# EAGLE design OutputZTester (EAGLE 7.2.0)

## Sheet 1 of 3: Droop Circuit
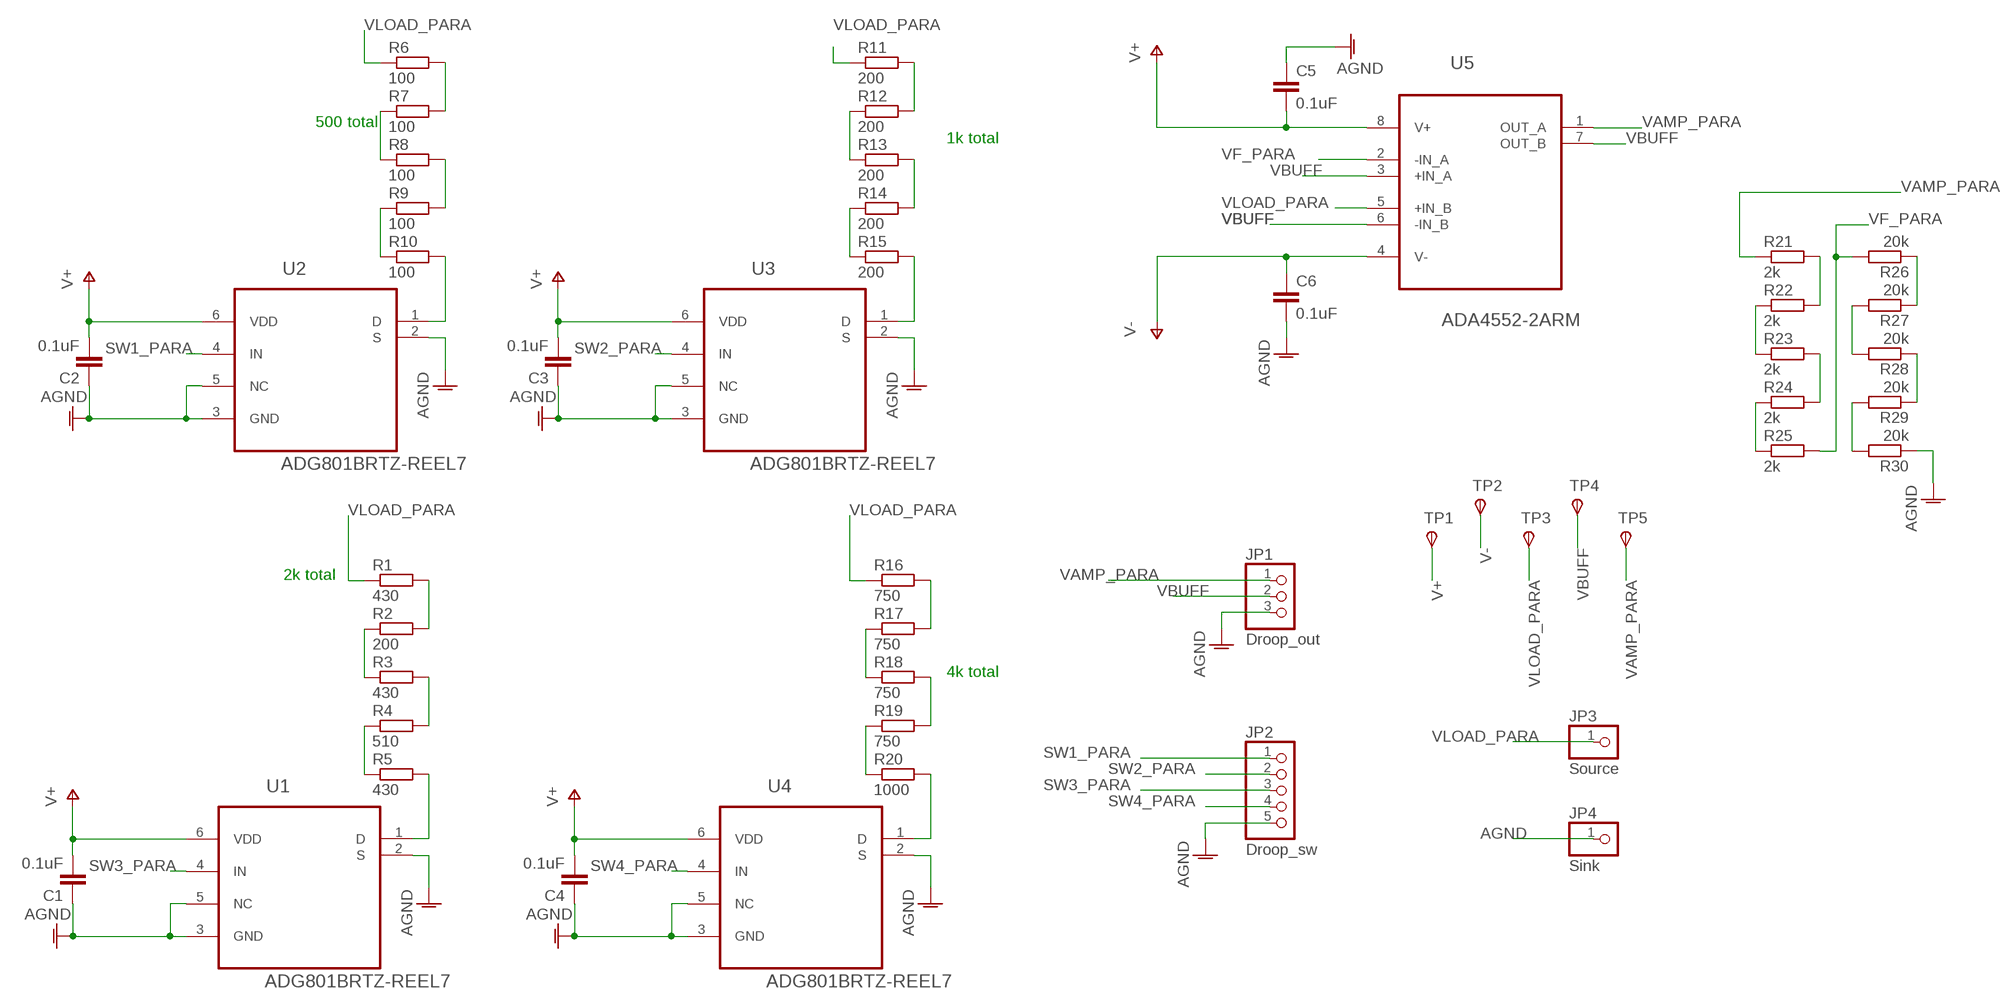
[diagram p0: schematic, sheet 1]

### Parts
C1  0.1uF  C-EUC0402  [C0402]
C2  0.1uF  C-EUC0402  [C0402]
C3  0.1uF  C-EUC0402  [C0402]
C4  0.1uF  C-EUC0402  [C0402]
C5  0.1uF  C-EUC0402  [C0402]
C6  0.1uF  C-EUC0402  [C0402]
JP1  Droop_out  PINHD-1X3/90  [1X03/90]
JP2  Droop_sw  PINHD-1X5/90  [1X05/90]
JP3  Source  PINHD-1X1  [1X01]
JP4  Sink  PINHD-1X1  [1X01]
R1  430  R-EU_R0402  [R0402]
R2  200  R-EU_R0402  [R0402]
R3  430  R-EU_R0402  [R0402]
R4  510  R-EU_R0402  [R0402]
R5  430  R-EU_R0402  [R0402]
R6  100  R-EU_R0402  [R0402]
R7  100  R-EU_R0402  [R0402]
R8  100  R-EU_R0402  [R0402]
R9  100  R-EU_R0402  [R0402]
R10  100  R-EU_R0402  [R0402]
R11  200  R-EU_R0402  [R0402]
R12  200  R-EU_R0402  [R0402]
R13  200  R-EU_R0402  [R0402]
R14  200  R-EU_R0402  [R0402]
R15  200  R-EU_R0402  [R0402]
R16  750  R-EU_R0402  [R0402]
R17  750  R-EU_R0402  [R0402]
R18  750  R-EU_R0402  [R0402]
R19  750  R-EU_R0402  [R0402]
R20  1000  R-EU_R0402  [R0402]
R21  2k  R-EU_R0402  [R0402]
R22  2k  R-EU_R0402  [R0402]
R23  2k  R-EU_R0402  [R0402]
R24  2k  R-EU_R0402  [R0402]
R25  2k  R-EU_R0402  [R0402]
R26  20k  R-EU_R0402  [R0402]
R27  20k  R-EU_R0402  [R0402]
R28  20k  R-EU_R0402  [R0402]
R29  20k  R-EU_R0402  [R0402]
R30  20k  R-EU_R0402  [R0402]
TP1  TPSB1,27  [B1,27]
TP2  TPSB1,27  [B1,27]
TP3  TPSB1,27  [B1,27]
TP4  TPSB1,27  [B1,27]
TP5  TPSB1,27  [B1,27]
U1  ADG801BRTZ-REEL7  [SOT95P280X145-6N]
U2  ADG801BRTZ-REEL7  [SOT95P280X145-6N]
U3  ADG801BRTZ-REEL7  [SOT95P280X145-6N]
U4  ADG801BRTZ-REEL7  [SOT95P280X145-6N]
U5  ADA4552-2ARM  [SOP65P490X110-8N]

### Nets
AGND: C1.1 C2.1 C3.1 C4.1 C5.1 C6.2 JP1.3 JP2.5 JP4.1 R30.1 U1.2(S) U1.3(GND) U1.5(NC) U2.2(S) U2.3(GND) U2.5(NC) U3.2(S) U3.3(GND) U3.5(NC) U4.2(S) U4.3(GND) U4.5(NC) ; also sheet 2,3
N$2: R21.2 R22.2
N$3: R22.1 R23.1
N$4: R23.2 R24.2
N$5: R24.1 R25.1
N$6: R11.2 R12.2
N$7: R29.2 R30.2
N$8: R28.1 R29.1
N$9: R27.2 R28.2
N$10: R26.1 R27.1
N$11: R12.1 R13.1
N$12: R13.2 R14.2
N$13: R14.1 R15.1
N$14: R15.2 U3.1(D)
N$15: R1.2 R2.2
N$16: R2.1 R3.1
N$17: R3.2 R4.2
N$18: R4.1 R5.1
N$19: R5.2 U1.1(D)
N$20: R16.2 R17.2
N$21: R17.1 R18.1
N$22: R18.2 R19.2
N$23: R19.1 R20.1
N$24: R20.2 U4.1(D)
N$26: R6.2 R7.2
N$27: R7.1 R8.1
N$28: R8.2 R9.2
N$29: R9.1 R10.1
N$31: R10.2 U2.1(D)
SW1_PARA: JP2.1 U2.4(IN)
SW2_PARA: JP2.2 U3.4(IN)
SW3_PARA: JP2.3 U1.4(IN)
SW4_PARA: JP2.4 U4.4(IN)
V+: C1.2 C2.2 C3.2 C4.2 C5.2 TP1.TP(PP) U1.6(VDD) U2.6(VDD) U3.6(VDD) U4.6(VDD) U5.8(V+) ; also sheet 2,3
V-: C6.1 TP2.TP(PP) U5.4(V-) ; also sheet 2,3
VAMP_PARA: JP1.1 R21.1 TP5.TP(PP) U5.1(OUT_A)
VBUFF: JP1.2 TP4.TP(PP) U5.3(+IN_A) U5.6(-IN_B) U5.7(OUT_B)
VF_PARA: R25.2 R26.2 U5.2(-IN_A)
VLOAD_PARA: JP3.1 R1.1 R6.1 R11.1 R16.1 TP3.TP(PP) U5.5(+IN_B)

### Notes on the sheet
- 500 total
- 1k total
- 2k total
- 4k total

## Sheet 2 of 3: Power
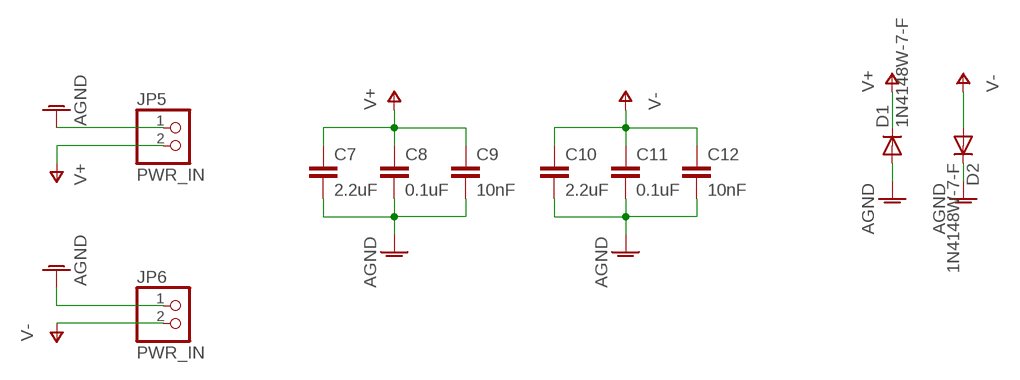
[diagram p1: schematic, sheet 2]

### Parts
C7  2.2uF  C-EUC0402  [C0402]
C8  0.1uF  C-EUC0402  [C0402]
C9  10nF  C-EUC0402  [C0402]
C10  2.2uF  C-EUC0402  [C0402]
C11  0.1uF  C-EUC0402  [C0402]
C12  10nF  C-EUC0402  [C0402]
D1  1N4148W-7-F  DIODE-SOD123  [SOD123]
D2  1N4148W-7-F  DIODE-SOD123  [SOD123]
JP5  PWR_IN  PINHD-1X2/90  [1X02/90]
JP6  PWR_IN  PINHD-1X2/90  [1X02/90]

### Nets
AGND: C7.2 C8.2 C9.2 C10.2 C11.2 C12.2 D1.A D2.C JP5.1 JP6.1 ; also sheet 1,3
V+: C7.1 C8.1 C9.1 D1.C JP5.2 ; also sheet 1,3
V-: C10.1 C11.1 C12.1 D2.A JP6.2 ; also sheet 1,3

## Sheet 3 of 3: TIA Circuit
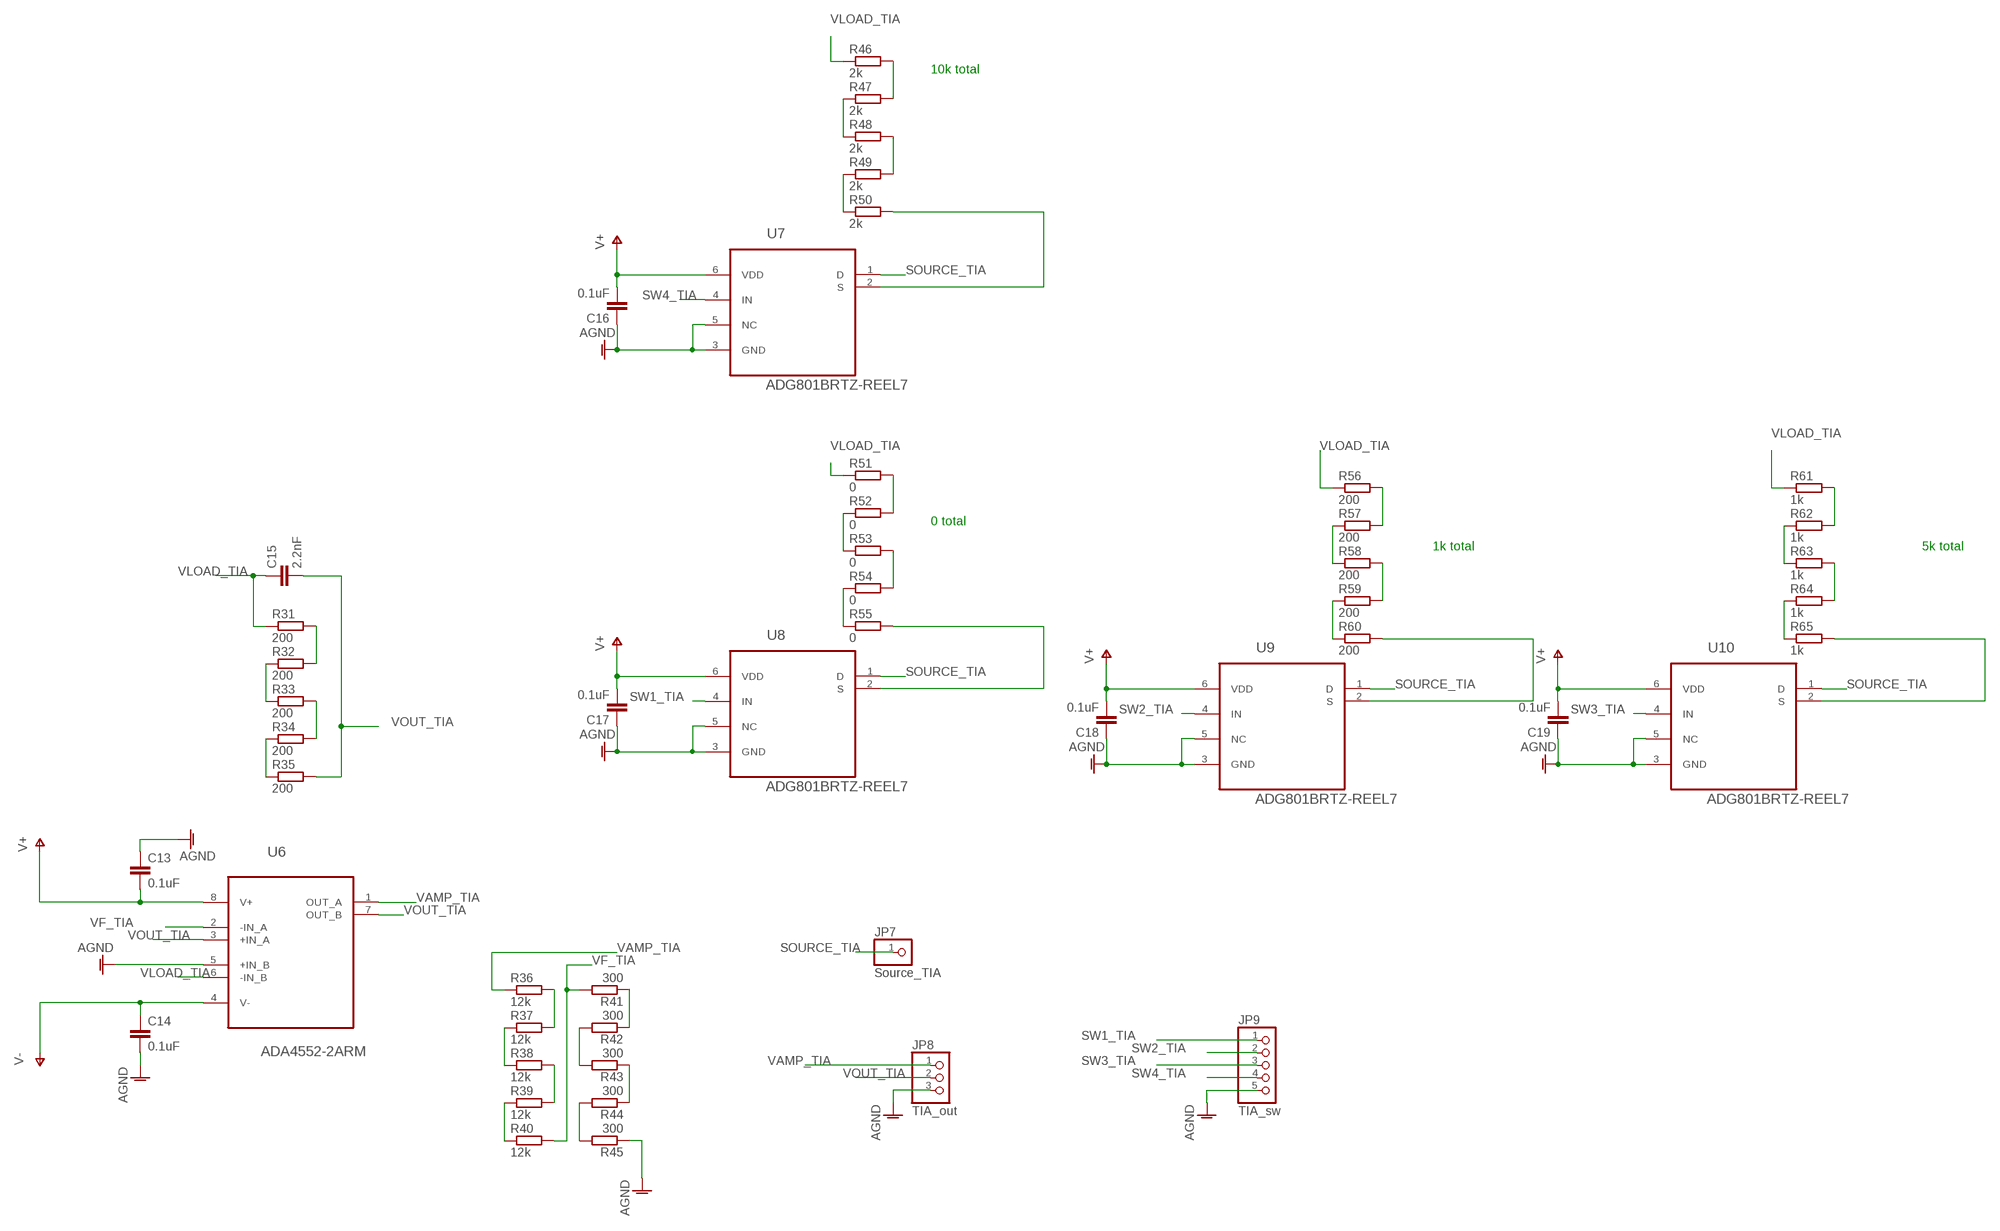
[diagram p2: schematic, sheet 3]

### Parts
C13  0.1uF  C-EUC0402  [C0402]
C14  0.1uF  C-EUC0402  [C0402]
C15  2.2nF  C-EUC0402  [C0402]
C16  0.1uF  C-EUC0402  [C0402]
C17  0.1uF  C-EUC0402  [C0402]
C18  0.1uF  C-EUC0402  [C0402]
C19  0.1uF  C-EUC0402  [C0402]
JP7  Source_TIA  PINHD-1X1  [1X01]
JP8  TIA_out  PINHD-1X3/90  [1X03/90]
JP9  TIA_sw  PINHD-1X5/90  [1X05/90]
R31  200  R-EU_R0402  [R0402]
R32  200  R-EU_R0402  [R0402]
R33  200  R-EU_R0402  [R0402]
R34  200  R-EU_R0402  [R0402]
R35  200  R-EU_R0402  [R0402]
R36  12k  R-EU_R0402  [R0402]
R37  12k  R-EU_R0402  [R0402]
R38  12k  R-EU_R0402  [R0402]
R39  12k  R-EU_R0402  [R0402]
R40  12k  R-EU_R0402  [R0402]
R41  300  R-EU_R0402  [R0402]
R42  300  R-EU_R0402  [R0402]
R43  300  R-EU_R0402  [R0402]
R44  300  R-EU_R0402  [R0402]
R45  300  R-EU_R0402  [R0402]
R46  2k  R-EU_R0402  [R0402]
R47  2k  R-EU_R0402  [R0402]
R48  2k  R-EU_R0402  [R0402]
R49  2k  R-EU_R0402  [R0402]
R50  2k  R-EU_R0402  [R0402]
R51  0  R-EU_R0402  [R0402]
R52  0  R-EU_R0402  [R0402]
R53  0  R-EU_R0402  [R0402]
R54  0  R-EU_R0402  [R0402]
R55  0  R-EU_R0402  [R0402]
R56  200  R-EU_R0402  [R0402]
R57  200  R-EU_R0402  [R0402]
R58  200  R-EU_R0402  [R0402]
R59  200  R-EU_R0402  [R0402]
R60  200  R-EU_R0402  [R0402]
R61  1k  R-EU_R0402  [R0402]
R62  1k  R-EU_R0402  [R0402]
R63  1k  R-EU_R0402  [R0402]
R64  1k  R-EU_R0402  [R0402]
R65  1k  R-EU_R0402  [R0402]
U6  ADA4552-2ARM  [SOP65P490X110-8N]
U7  ADG801BRTZ-REEL7  [SOT95P280X145-6N]
U8  ADG801BRTZ-REEL7  [SOT95P280X145-6N]
U9  ADG801BRTZ-REEL7  [SOT95P280X145-6N]
U10  ADG801BRTZ-REEL7  [SOT95P280X145-6N]

### Nets
AGND: C13.1 C14.2 C16.1 C17.1 C18.1 C19.1 JP8.3 JP9.5 R45.1 U6.5(+IN_B) U7.3(GND) U7.5(NC) U8.3(GND) U8.5(NC) U9.3(GND) U9.5(NC) U10.3(GND) U10.5(NC) ; also sheet 1,2
N$1: R36.2 R37.2
N$25: R37.1 R38.1
N$30: R38.2 R39.2
N$32: R39.1 R40.1
N$33: R44.2 R45.2
N$34: R43.1 R44.1
N$35: R42.2 R43.2
N$36: R41.1 R42.1
N$37: R31.2 R32.2
N$38: R32.1 R33.1
N$39: R33.2 R34.2
N$40: R34.1 R35.1
N$41: R51.2 R52.2
N$42: R52.1 R53.1
N$43: R53.2 R54.2
N$44: R54.1 R55.1
N$46: R55.2 U8.2(S)
N$47: R56.2 R57.2
N$48: R57.1 R58.1
N$49: R58.2 R59.2
N$50: R59.1 R60.1
N$51: R60.2 U9.2(S)
N$52: R61.2 R62.2
N$53: R62.1 R63.1
N$54: R63.2 R64.2
N$55: R64.1 R65.1
N$56: R65.2 U10.2(S)
N$57: R46.2 R47.2
N$58: R47.1 R48.1
N$59: R48.2 R49.2
N$60: R49.1 R50.1
N$61: R50.2 U7.2(S)
SOURCE_TIA: JP7.1 U7.1(D) U8.1(D) U9.1(D) U10.1(D)
SW1_TIA: JP9.1 U8.4(IN)
SW2_TIA: JP9.2 U9.4(IN)
SW3_TIA: JP9.3 U10.4(IN)
SW4_TIA: JP9.4 U7.4(IN)
V+: C13.2 C16.2 C17.2 C18.2 C19.2 U6.8(V+) U7.6(VDD) U8.6(VDD) U9.6(VDD) U10.6(VDD) ; also sheet 1,2
V-: C14.1 U6.4(V-) ; also sheet 1,2
VAMP_TIA: JP8.1 R36.1 U6.1(OUT_A)
VF_TIA: R40.2 R41.2 U6.2(-IN_A)
VLOAD_TIA: C15.1 R31.1 R46.1 R51.1 R56.1 R61.1 U6.6(-IN_B)
VOUT_TIA: C15.2 JP8.2 R35.2 U6.3(+IN_A) U6.7(OUT_B)

### Notes on the sheet
- 10k total
- 0 total
- 1k total | 5k total

## Library data of the parts
C1-C19 = rcl:C-EU: CAPACITOR, European symbol
D1 D2 = diode:DIODE-: DIODE
JP1 JP8 = pinhead:PINHD-1X3: PIN HEADER
JP2 JP9 = pinhead:PINHD-1X5: PIN HEADER
JP3 JP4 JP7 = pinhead:PINHD-1X1: PIN HEADER
JP5 JP6 = pinhead:PINHD-1X2: PIN HEADER
R1-R65 = rcl:R-EU_: RESISTOR, European symbol
TP1-TP5 = testpad:TPS: TEST PIN
U1-U4 U7-U10 = Analog Devices_By_element14_Batch_1:ADG801BRTZ-REEL7: <0.4 Ù CMOS 1.8 V to 5.5 V SPST Switches; MPN: ADG801BRTZ-REEL7; OC_FARNELL: 1838889; OC_NEWARK: 59K1626; PACKAGE: SOT-23-6; SUPPLIER: Analog Devices
U5 U6 = ScouseTomLib:ADA4552-2ARM: 16 V, 1 MHz, CMOS Rail-to-Rail Input/Output Operational Amplifier; MPN: ADA4552-2ARMZ; OC_FARNELL: -; OC_NEWARK: 71P7789; PACKAGE: MSOP-8; SUPPLIER: Analog Devices

## Board
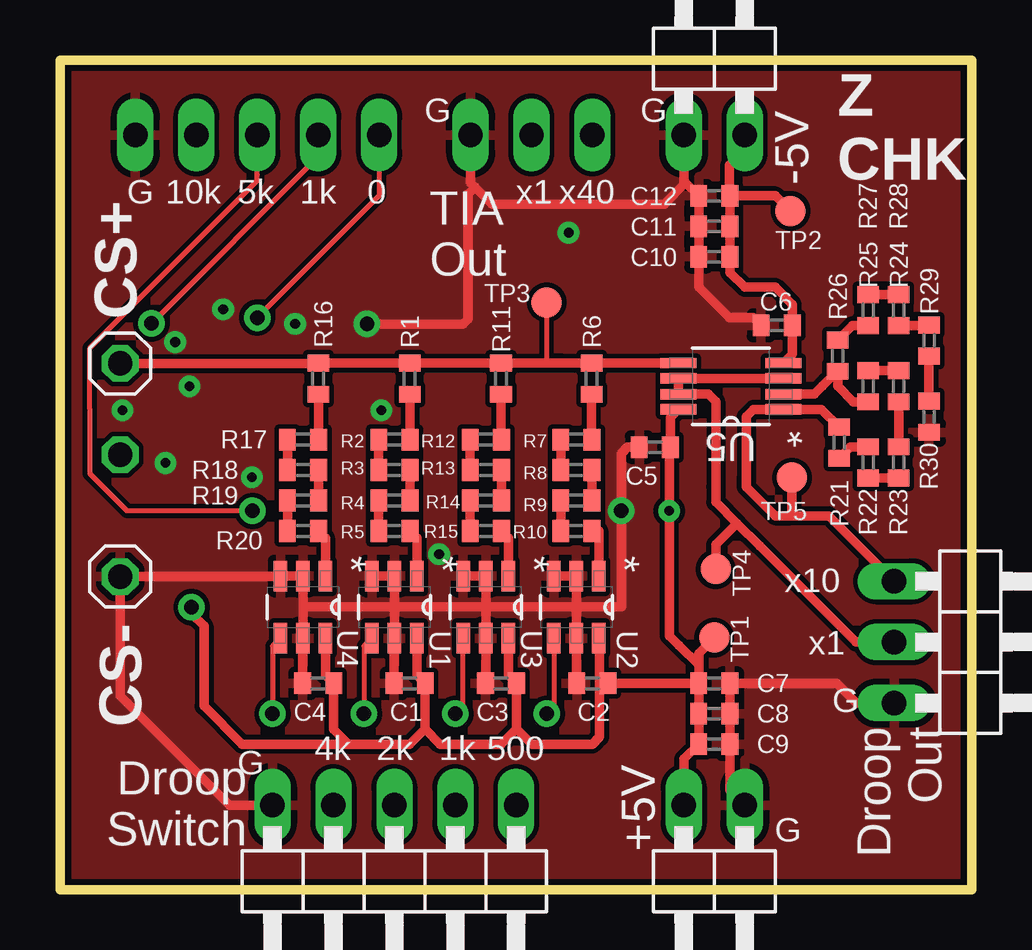
[diagram p3: board, top side]
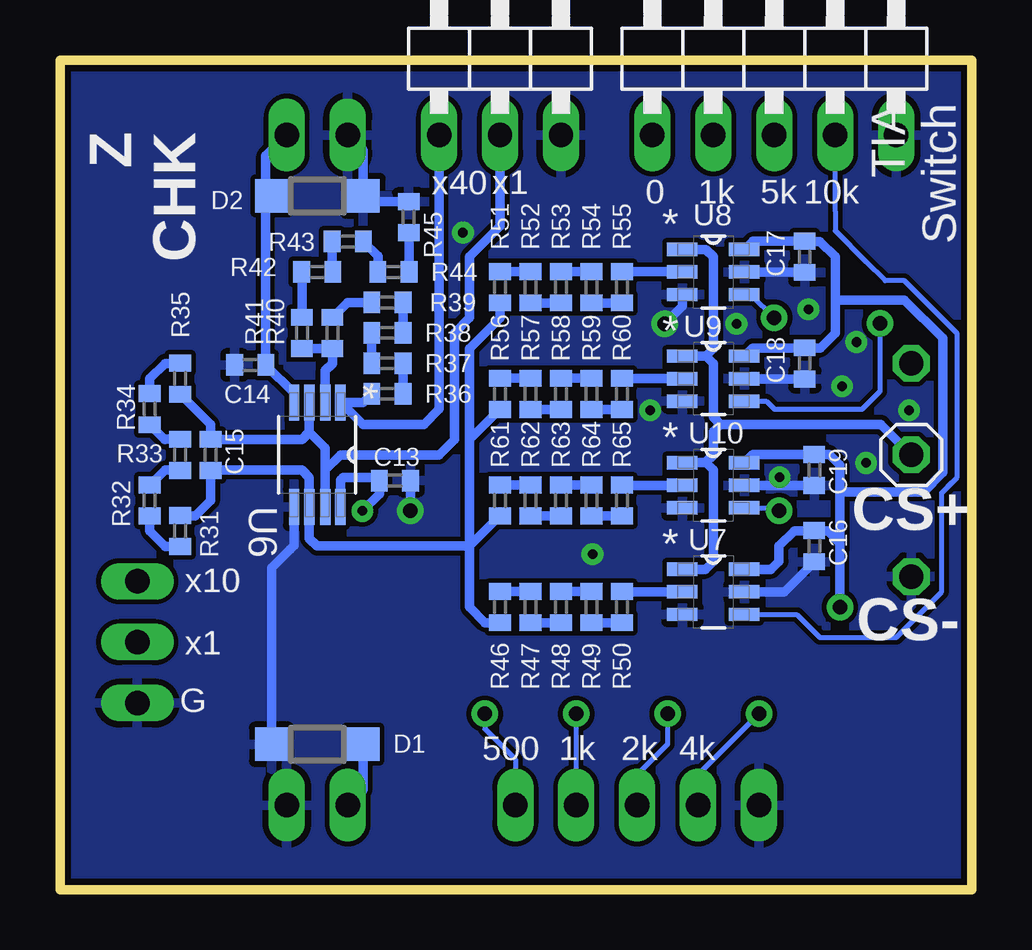
[diagram p4: board, bottom side, seen from below]

Size 38 x 34.6 mm. Coordinates in mm from the lower left corner, seen from the top.
Outline: 0,0 38,0 38,34.6 0,34.6 0,0
Copper layers (1*16): Top 0.035mm / dielectric 1.5mm / Bottom 0.035mm
Design rules "pcbtrain": minimum track width 0.2mm, minimum drill 0.4mm, track to track 0.2mm, track to pad 0.2mm, pad to pad 0.2mm, via to via 0.2mm, smd to smd 0mil, copper to edge 10mil, drill to drill 0.2mm, minimum pad ring 10mil, minimum via ring 10mil, stop-mask expansion 0.125mm, vias tented up to drill 0mil, thermal gap 10mil

### Footprints (pad centres in the part's own frame; a part is rotated, then mirrored left to right if it is on the bottom)
C0402 = smd 0.7 x 0.9: 1 -0.65,0; 2 0.65,0
SOD123 = smd 1.4 x 1.4: A 1.9,0; C -1.9,0
1X03/90 = drill 1.016 long: 1 -2.54,-3.81; 2 0,-3.81; 3 2.54,-3.81
1X05/90 = drill 1.016 long: 1 -5.08,-3.81; 2 -2.54,-3.81; 3 0,-3.81; 4 2.54,-3.81; 5 5.08,-3.81
1X01 = drill 1.016 octagon: 1 0,0
1X02/90 = drill 1.016 long: 1 -1.27,-3.81; 2 1.27,-3.81
R0402 = smd 0.7 x 0.9: 1 -0.65,0; 2 0.65,0
B1,27 = smd 1.27 x 1.27: TP 0,0
SOT95P280X145-6N = smd 1.27 x 0.559: 1 -1.295,0.94; 2 -1.295,0; 3 -1.295,-0.94; 4 1.295,-0.94; 5 1.295,0; 6 1.295,0.94
SOP65P490X110-8N = smd 1.499 x 0.432: 1 -2.184,0.965; 2 -2.184,0.33; 3 -2.184,-0.33; 4 -2.184,-0.965; 5 2.184,-0.965; 6 2.184,-0.33; 7 2.184,0.33; 8 2.184,0.965

### Placement (x,y rotation side)
C1  14.57,8.61 0 top
C2  22.2,8.61 0 top
C3  18.38,8.61 0 top
C4  10.77,8.61 0 top
C5  24.8,18.46 0 top
C6  29.88,23.54 180 top
C7  27.27,8.61 0 top
C8  27.27,7.34 0 top
C9  27.27,6.07 0 top
C10  27.27,26.39 180 top
C11  27.27,27.67 180 top
C12  27.27,28.93 180 top
C13  24.03,17.06 180 bottom
C14  30.07,21.89 180 bottom
C15  31.72,18.14 90 bottom
C16  6.55,14.33 90 bottom
C17  6.95,26.39 90 bottom
C18  6.95,21.95 90 bottom
C19  6.55,17.5 90 bottom
D1  27.27,6.07 180 bottom
D2  27.27,28.93 180 bottom
JP1  38.59,10.33 270 top
JP2  13.94,-0.28 180 top
JP3  2.51,21.95 0 top
JP4  2.51,13.06 0 top
JP5  27.27,-0.28 180 top
JP6  27.27,35.28 0 top
JP7  2.51,18.14 0 bottom
JP8  19.66,35.28 0 bottom
JP9  8.23,35.28 0 bottom
R1  14.57,21.31 270 top
R2  13.94,18.77 0 top
R3  13.94,17.5 0 top
R4  13.94,16.23 0 top
R5  13.94,14.96 0 top
R6  22.16,21.31 270 top
R7  21.52,18.77 0 top
R8  21.52,17.5 0 top
R9  21.52,16.23 0 top
R10  21.52,14.96 0 top
R11  18.38,21.31 270 top
R12  17.75,18.77 0 top
R13  17.75,17.5 0 top
R14  17.75,16.23 0 top
R15  17.75,14.96 0 top
R16  10.77,21.31 270 top
R17  10.13,18.77 0 top
R18  10.13,17.5 0 top
R19  10.13,16.23 0 top
R20  10.13,14.96 0 top
R21  32.48,18.65 270 top
R22  33.69,17.82 90 top
R23  34.96,17.82 90 top
R24  34.96,21 270 top
R25  33.69,21 270 top
R26  32.42,22.27 270 top
R27  33.69,24.17 90 top
R28  34.96,24.17 90 top
R29  36.23,22.9 270 top
R30  36.23,19.73 90 top
R31  32.99,14.96 270 bottom
R32  34.26,16.23 270 bottom
R33  32.99,18.14 90 bottom
R34  34.26,20.04 270 bottom
R35  32.99,21.31 270 bottom
R36  24.35,20.68 0 bottom
R37  24.35,21.95 0 bottom
R38  24.35,23.22 0 bottom
R39  24.35,24.49 0 bottom
R40  26.64,23.22 270 bottom
R41  27.91,23.22 270 bottom
R42  27.27,25.76 0 bottom
R43  26.01,27.03 180 bottom
R44  24.1,25.76 0 bottom
R45  23.47,28.05 270 bottom
R46  19.66,11.79 90 bottom
R47  18.38,11.79 90 bottom
R48  17.11,11.79 90 bottom
R49  15.84,11.79 90 bottom
R50  14.57,11.79 90 bottom
R51  19.66,25.12 90 bottom
R52  18.38,25.12 90 bottom
R53  17.11,25.12 90 bottom
R54  15.84,25.12 90 bottom
R55  14.57,25.12 90 bottom
R56  19.66,20.68 90 bottom
R57  18.38,20.68 90 bottom
R58  17.11,20.68 90 bottom
R59  15.84,20.68 90 bottom
R60  14.57,20.68 90 bottom
R61  19.66,16.23 90 bottom
R62  18.38,16.23 90 bottom
R63  17.11,16.23 90 bottom
R64  15.84,16.23 90 bottom
R65  14.57,16.23 90 bottom
TP1  27.27,10.52 180 top
TP2  30.45,28.3 0 top
TP3  20.29,24.49 270 top
TP4  27.34,13.38 180 top
TP5  30.51,17.19 180 top
U1  13.94,11.79 270 top
U2  21.52,11.79 270 top
U3  17.75,11.79 270 top
U4  10.13,11.79 270 top
U5  27.97,21 180 top
U6  27.27,18.14 270 bottom
U7  10.77,12.43 0 bottom
U8  10.77,25.76 0 bottom
U9  10.77,21.31 0 bottom
U10  10.77,16.87 0 bottom

### Tracks (layer width: path | path; a pad name or v marks a point on that pad's centre or on a via)
AGND  (via drill 0.4 pad 0.2, 0.4 pad 0.4, 0.6)
  Top 0.4: U2.3 U2.2 21.52,11.79 | 21.56,8.63 C2.1 21.52,8.63 U2.5 21.52,11.79 | C4.1 10.11,10.48 U4.5 10.13,11.79 | C1.1 13.93,10.48 U1.5 13.94,11.79 | C3.1 17.75,8.63 U3.5 17.75,11.79 | U1.3 U1.2 13.94,11.79 | U3.3 U3.2 17.75,11.79 | 10.13,11.79 13.94,11.79 | 13.94,11.79 17.75,11.79 | 17.75,11.79 21.52,11.79 | 10.13,11.79 U4.2 U4.3 9.16,13.06 JP4.1 2.51,8.09 3.2,7.4 | R30.1 36.24,19.09 | 29.24,23.55 C6.2 28.91,23.86 27.91,23.86 26.62,25.14 C10.2 C11.2 C12.2 26.08,29.48 | JP5.1 27.92,4.15 C9.2 C8.2 C7.2 32.38,8.61 33.2,7.8 34.8,7.8 35,7.8 | JP6.1 26.01,29.55 26.08,29.48 | JP8.3 17.11,30.21 17.11,29.48 17.3,29.3 | 17.3,29.3 18,28.6 25.2,28.6 26.08,29.48 | 21.52,11.79 21.53,11.8 23.4,11.8 23.4,12.6 v23.4,15.8 23.4,18.2 23.66,18.46 C5.1 | JP2.5 7.07,3.54 3.2,7.4 | 3.2,7.4 2.8,7.8 | v12.8,23.6 16.8,23.6 17,23.8 17,29 17.3,29.3 | 35,7.8 35.2,7.6 35,7.8
  Bottom 0.4: C19.1 9.45,16.86 U10.5 | U7.5 8.01,12.43 7.81,12.43 C16.1 | C18.1 9.45,21.3 U9.5 | U8.5 6.97,25.76 C17.1 | R45.1 25.14,28.7 D2.C 25.38,30.85 JP6.1 | D1.A 29.17,13.2 29.17,13.43 28.4,14.2 28.24,14.36 U6.5 | C13.1 23.38,16.38 v23.4,15.8 | U8.3 12.06,24.34 v12.8,23.6
  other vias: 6.8,24.2 5.4,21 2.6,20 8,17.2 21.2,27.4 13.4,20 4.4,17.8 9.8,23.6 4.8,22.84 15.8,14
  pour Bottom: 0.2,34.6 38,34.6 38,0 0.2,0
  pour Top: 0.2,34.6 38,34.6 38,0 0.2,0
N$1
  Bottom 0.4: R36.2 R37.2
N$2
  Top 0.4: R22.2 32.96,18.47 R21.2
N$3
  Top 0.4: R22.1 R23.1
N$4
  Top 0.4: R23.2 R24.2
N$5
  Top 0.4: R24.1 R25.1
N$6
  Top 0.4: R12.2 18.38,18.79 R11.2
N$7
  Top 0.4: R29.2 R30.2
N$8
  Top 0.4: R28.1 36.2,23.52 R29.1
N$9
  Top 0.4: R27.2 R28.2
N$10
  Top 0.4: R27.1 33.02,23.52 R26.1
N$11
  Top 0.4: R13.1 R12.1
N$12
  Top 0.4: R14.2 R13.2
N$13
  Top 0.4: R15.1 R14.1
N$14
  Top 0.4: R15.2 18.69,14.68 U3.1
N$15
  Top 0.4: R1.2 14.59,20.65 R2.2
N$16
  Top 0.4: R3.1 R2.1
N$17
  Top 0.4: R4.2 R3.2
N$18
  Top 0.4: R5.1 R4.1
N$19
  Top 0.4: R5.2 14.88,14.68 U1.1
N$20
  Top 0.4: R16.2 R17.2
N$21
  Top 0.4: R18.1 R17.1
N$22
  Top 0.4: R19.2 R18.2
N$23
  Top 0.4: R20.1 R19.1
N$24
  Top 0.4: R20.2 11.07,14.68 U4.1
N$25
  Bottom 0.4: R37.1 R38.1
N$26
  Top 0.4: R7.2 R6.2
N$27
  Top 0.4: R8.1 R7.1
N$28
  Top 0.4: R9.2 R8.2
N$29
  Top 0.4: R10.1 R9.1
N$30
  Bottom 0.4: R38.2 R39.2
N$31
  Top 0.4: R10.2 22.47,14.96 U2.1
N$32
  Bottom 0.4: R39.1 26.02,24.49 R40.1
N$33
  Bottom 0.4: R44.2 23.45,27.38 R45.2
N$34
  Bottom 0.4: R44.1 24.75,26.43 R43.1
N$35
  Bottom 0.4: R43.2 26.66,25.79 R42.2
N$36
  Bottom 0.4: R41.1 27.91,25.75 R42.1
N$37
  Bottom 0.4: R31.2 33.61,14.31 34.26,14.96 R32.2
N$38
  Bottom 0.4: R32.1 34.24,16.88 33.62,17.5 33.01,17.5 R33.1
N$39
  Bottom 0.4: R33.2 33.61,18.79 33.62,18.77 33.64,18.77 R34.2
N$40
  Bottom 0.4: R34.1 34.26,21.31 33.62,21.95 33.01,21.95 R35.1
N$41
  Bottom 0.4: R52.2 R51.2
N$42
  Bottom 0.4: R53.1 R52.1
N$43
  Bottom 0.4: R54.2 R53.2
N$44
  Bottom 0.4: R55.1 R54.1
N$46
  Bottom 0.4: R55.2 12.07,25.78 U8.2
N$47
  Bottom 0.4: R57.2 R56.2
N$48
  Bottom 0.4: R58.1 R57.1
N$49
  Bottom 0.4: R59.2 R58.2
N$50
  Bottom 0.4: R60.1 R59.1
N$51
  Bottom 0.4: U9.2 14.56,21.31 R60.2
N$52
  Bottom 0.4: R62.2 R61.2
N$53
  Bottom 0.4: R63.1 R62.1
N$54
  Bottom 0.4: R64.2 R63.2
N$55
  Bottom 0.4: R65.1 R64.1
N$56
  Bottom 0.4: U10.2 R65.2
N$57
  Bottom 0.4: R47.2 R46.2
N$58
  Bottom 0.4: R48.1 R47.1
N$59
  Bottom 0.4: R49.2 R48.2
N$60
  Bottom 0.4: R50.1 R49.1
N$61
  Bottom 0.4: U7.2 14.56,12.43 R50.2
SOURCE_TIA
  Bottom 0.4: 10.46,19.41 5.68,19.41 3.78,19.41 JP7.1 | U8.1 11.07,26.7 10.77,26.39 10.77,24.49 10.77,22.56 11.07,22.25 | U9.1 11.07,22.25 | 11.07,22.25 10.77,21.95 10.77,19.71 10.46,19.41 | U7.1 11.09,13.36 10.77,13.7 10.77,17.5 11.07,17.81 | U10.1 11.07,17.81 | 11.07,17.81 11.07,17.84 10.77,18.14 10.77,19.11 10.46,19.41
SW1_PARA  (via drill 0.6)
  Top 0.2: U2.4 20.59,7.64 v20.29,7.34
  Bottom 0.2: v20.29,7.34 20.29,6.71 19.02,5.44 JP2.1
SW1_TIA  (via drill 0.6)
  Top 0.2: v8.23,23.86 13.3,28.93 JP9.1
  Bottom 0.2: U8.4 9.19,24.82 v8.23,23.86
SW2_PARA  (via drill 0.6)
  Top 0.2: v16.48,7.34 16.81,7.68 U3.4
  Bottom 0.2: v16.48,7.34 JP2.2
SW2_TIA  (via drill 0.6)
  Top 0.2: JP9.2 10.77,30.8 10.77,30.57 v3.82,23.62
  Bottom 0.2: U9.4 8.55,20.38 8.23,20.04 5.68,20.04 4.64,20.04 4.55,20.04 3.82,20.79 v3.82,23.62
SW3_PARA  (via drill 0.6)
  Top 0.2: U1.4 12.67,10.16 v12.67,7.34
  Bottom 0.2: v12.67,7.34 12.67,6.07 13.94,4.8 JP2.3
SW3_TIA  (via drill 0.6)
  Top 0.2: v8.02,15.8 2.8,15.8 1.24,17.36 1.24,20.04 1.24,22.58 2.51,23.86 8.23,29.57 8.23,29.8 JP9.3
  Bottom 0.2: U10.4 8.36,15.93 8.16,15.93 v8.02,15.8
SW4_PARA  (via drill 0.6)
  Top 0.2: U4.4 8.86,10.16 v8.86,7.34
  Bottom 0.2: JP2.4 11.4,4.8 v8.86,7.34
SW4_TIA
  Bottom 0.2: U7.4 7.29,11.48 6.32,10.52 3.14,10.52 1.24,12.43 1.24,16.56 1.2,16.6 | JP9.4 5.68,28.3 5.68,27.48 4.4,26.2 3.6,25.4 2.8,25.4 0.6,23.2 0.6,17.2 1.2,16.6 | 1.2,16.6 0.8,17
V+  (via drill 0.4 pad 0.2, 0.6)
  Top 0.4: 22.5,8.96 C2.2 C7.1 | U4.6 11.07,8.96 C4.2 11.41,6.7 12.04,6.07 | U1.6 14.88,8.96 C1.2 15.21,6.71 | U3.6 18.69,8.96 C3.2 19.03,6.72 | 12.04,6.07 14.57,6.07 15.21,6.71 | 19.03,6.72 18.38,6.07 15.84,6.07 15.21,6.71 | 22.5,8.96 22.5,6.38 22.2,6.07 19.69,6.07 19.03,6.72 | U5.8 25.45,19.69 C5.2 25.4,18.41 v25.4,15.8 25.4,10.6 25.8,10.2 26.62,9.38 | JP5.2 26.01,5.46 C9.1 C8.1 C7.1 | 12.04,6.07 8.23,6.07 7.59,6.07 6,7.66 6,11 5.48,11.52 v5.48,11.79 | C7.1 26.62,9.38 | TP1.TP 26.62,9.87 26.62,9.38 | 22.5,8.96 22.5,10.46 U2.6
  Bottom 0.4: U8.6 9.12,27.04 C17.2 6.32,27.03 5.68,26.39 5.68,24.6 | U9.6 9.12,22.6 C18.2 | U10.6 9.12,18.15 C19.2 5.93,18.15 5.48,17.7 5.48,16.6 | C18.2 6.3,22.6 5.68,23.22 5.68,23.86 5.68,24.49 5.68,24.6 | C18.2 6.95,22.58 | D1.C 25.38,4.16 JP5.2 | 6.54,14.96 6,14.96 5.48,14.45 5.48,14.2 | 6.54,14.96 C16.2 | U7.6 8.36,13.36 8.02,13.7 8.02,14.33 7.39,14.96 6.54,14.96 | v5.48,11.79 5.48,14.2 | 5.48,16.6 5.48,14.2 | 5.48,16.6 2,16.6 1.2,17.4 1.2,21.99 1.2,23 2.8,24.6 5.68,24.6 | U6.8 26.31,17.09 26.2,17.2 24.82,17.2 C13.2 24.69,16.52 v25.4,15.8
V-
  Top 0.4: U5.4 30.53,22.33 C6.1 30.53,24.41 29.81,25.12 28.55,25.12 27.92,25.75 C10.1 C11.1 C12.1 | TP2.TP 29.81,28.93 C12.1 | JP6.2 28.55,30.84 27.91,30.21 27.91,28.95 C12.1
  Bottom 0.4: 29.42,28.69 C14.1 28.24,20.71 U6.4 | 29.42,28.69 D2.A | 29.42,28.69 29.42,30.6 JP6.2
VAMP_PARA
  Top 0.4: R21.1 31.75,20.03 U5.1 28.91,20.03 28.61,19.73 28.61,17.19 28.61,16.81 29.81,15.6 30.2,15.6 | 30.2,15.6 30.45,15.6 30.51,15.66 TP5.TP | JP1.1 32.05,15.6 30.2,15.6
VAMP_TIA
  Bottom 0.4: JP8.1 22.2,20.04 22.83,19.41 25.37,19.41 26.28,20.32 U6.1 25.36,20.32 R36.1
VBUFF
  Top 0.4: U5.3 U5.6 U5.7 27.03,20.67 27.34,20.36 27.34,16.81 27.34,16.17 28.23,15.28 | 28.23,15.28 29.18,14.33 33.18,10.33 JP1.2 | TP4.TP 27.34,14.39 28.23,15.28
VF_PARA
  Top 0.4: R25.2 33.07,20.35 32.42,21 R26.2 32.4,21.62 31.78,21 31.45,20.67 U5.2
VF_TIA
  Bottom 0.4: R41.2 R40.2 26.64,21.95 26.95,21.64 U6.2
VLOAD_PARA
  Top 0.2: TP3.TP 20.29,22.07 20.4,21.96
  Top 0.4: JP3.1 10.75,21.95 R16.1 R1.1 R11.1 20.4,21.96 20.89,21.96 R6.1 U5.5
VLOAD_TIA
  Bottom 0.4: R31.1 32.98,15.6 32.35,15.6 31.72,16.23 C15.1 31.7,17.5 27.91,17.5 27.6,17.2 U6.6 27.6,14.66 27.27,14.33 20.92,14.33 | 20.92,18.77 20.92,22.57 19.66,23.84 R51.1 | 20.92,18.77 20.92,14.33 | 20.92,14.33 20.92,11.79 20.27,11.14 R46.1 | R56.1 20.92,18.77 | R61.1 20.92,14.33
VOUT_TIA
  Bottom 0.4: U6.3 27.6,19.08 | 27.6,19.08 27.91,18.77 31.7,18.77 C15.2 31.72,19.39 R35.2 | U6.7 26.95,17.5 | 26.95,17.5 26.95,18.42 27.6,19.08 | JP8.2 19.66,27.67 20.92,26.39 20.92,23.86 21.56,23.22 21.56,18.77 22.2,18.14 23.47,18.14 24.1,18.14 26.31,18.14 26.95,17.5

### Text on the board
tPlace: G | G | -5V | Z / CHK | G | 10k | 5k | 1k | 0 | x1 | x40 | TIA / Out | CS+ | x10 | x1 | CS- | G | Droop / Out | G | Droop / Switch | 4k | 2k | 1k | 500 | G | +5V
bPlace: TIA / Switch | Z / CHK | x40 | x1 | 10k | 5k | 1k | 0 | CS+ | x10 | CS- | x1 | G | 4k | 2k | 1k | 500